# Altium schematic sheet Offboard_Outputs.SchDoc: Delayed Egress
size A4; CheckedBy: DMH; Organization: Detex; Address2: 302 Detex Dr; Address3: New Braunfels, TX 78130; Address4: (830) 629-290; DocumentNumber: 107027; Revision: A0; SheetNumber: 8; SheetTotal: 9
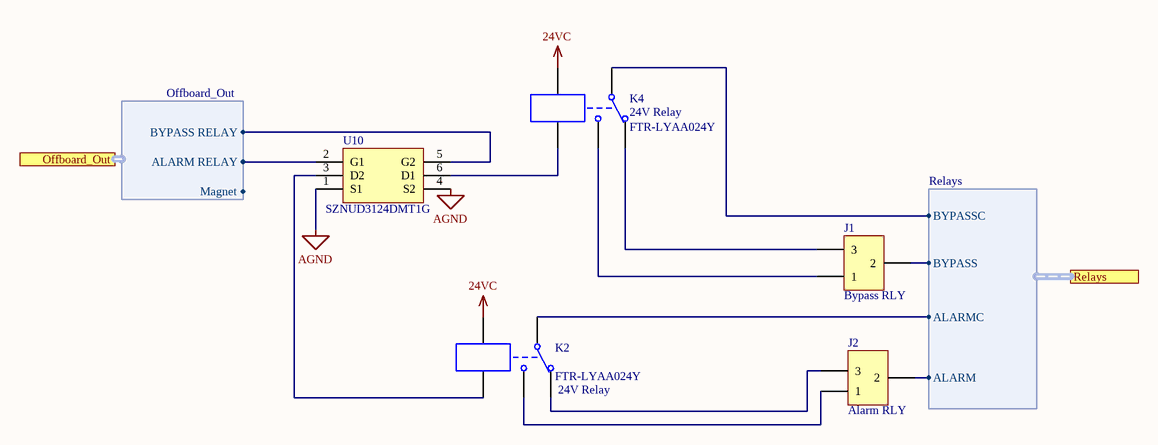
[diagram p0: Offboard_Outputs.SchDoc]

## Parts
J1  Bypass RLY  [3 Pin Header for Relay]
J2  Alarm RLY  [3 Pin Header for Relay]
K2  24V Relay  MFR P/N: FTR-LYAA024Y  [FTR-LY]
K4  24V Relay  MFR P/N: FTR-LYAA024Y  [FTR-LY]
U10  SZNUD3124DMT1G  [TI SOT-23-6 DDC]

## Ports
Offboard_Out (harness Offboard_Out), Relays (harness Relays)

## Harnesses
Offboard_Out: ALARM RELAY, BYPASS RELAY, Magnet
Relays: ALARMC, ALARM, BYPASSC, BYPASS

## Nets
24VC: K2.4 K4.4
AGND: U10.1(S1) U10.4(S2)
NetJ1_1: J1.1 K4.3(N/O)
NetJ1_2: J1.2 ; port Relays.BYPASS
NetJ1_3: J1.3 K4.2(N/C)
NetJ2_1: J2.1 K2.3(N/O)
NetJ2_2: J2.2 ; port Relays.ALARM
NetJ2_3: J2.3 K2.2(N/C)
NetK2_1: K2.1(COM) ; port Relays.ALARMC
NetK2_5: K2.5 U10.3(D2)
NetK4_1: K4.1(COM) ; port Relays.BYPASSC
NetK4_5: K4.5 U10.6(D1)
NetU10_2: U10.2(G1) ; port Offboard_Out.ALARM RELAY
NetU10_5: U10.5(G2) ; port Offboard_Out.BYPASS RELAY

## Notes on the sheet
- Title
- Size:
- Date:
- A4
- Number:
- Time:
- Revision:
- Sheet
- of
- Detex Corporation
- 302 Detex Drive
- New Braunfels, TX
- 78130
- (830) 629-2900
- File:

## Library data of the parts
J1 J2 = Header 3: Header, 3-Pin; Detex P/N: *; ComponentLink1Description: Datasheet
K2 K4 = Relay-SPDT: SPST (1 Form A); MFR: Fujitsu; Detex P/N: 106224; ComponentLink1Description: Datasheet
U10 = SZNUD3124DMT1G: Gate Drivers 24 V DUAL INDUCTIVE LOAD; MFR: ON Semiconductor; ComponentLink1URL: https://www.mouser.com/datasheet/2/308/NUD3124-D-1814421.pdf; ComponentLink1Description: Datasheet; MFR P/N: SZNUD3124DMT1G; PACKAGE: SC-74-6; Detex P/N: *